# Altium project MCU042A.PrjPcb (part 3 of 3)

## Sheet MCU042A_Antenna_RF .SchDoc
size 431 x 279 mm; Date: Not shown in title block; ApprovedBy: Not shown in title block; CheckedBy: Not shown in title block; Author: Not shown in title block; CompanyName: Not shown in title block; DrawnBy: Vince Rodriguez; Engineer: Not shown in title block; Organization: Not shown in title block; Address1: Not shown in title block; Address2: Not shown in title block; Address3: Not shown in title block; Address4: Not shown in title block; DocumentNumber: 4; Revision: Use project parameter SCH_Rev; SheetNumber: 4; SheetTotal: 5; PageSetup: Record=PageOptions|CenterHorizontal=True|CenterVertical=True|PrintScale=1.00|XCorrection=1.00|YCorrection=1.00|PrintKind=0|BorderSize=5000000|LeftOffset=0|BottomOffset=0|Orientation=2|PaperLength=1000|PaperWidth=1000|Scale=100|PaperSource=15|PrintQuality=600|MediaType=1|DitherType=10|PaperKind=Letter|PrintScaleMode=1; CurrentTime: Not shown in title block; CurrentDate: Not shown in title block; Time: Not shown in title block; DocumentFullPathAndName: Not shown in title block; DocumentName: Not shown in title block; ModifiedDate: Not shown in title block; ImagePath: Not shown in title block
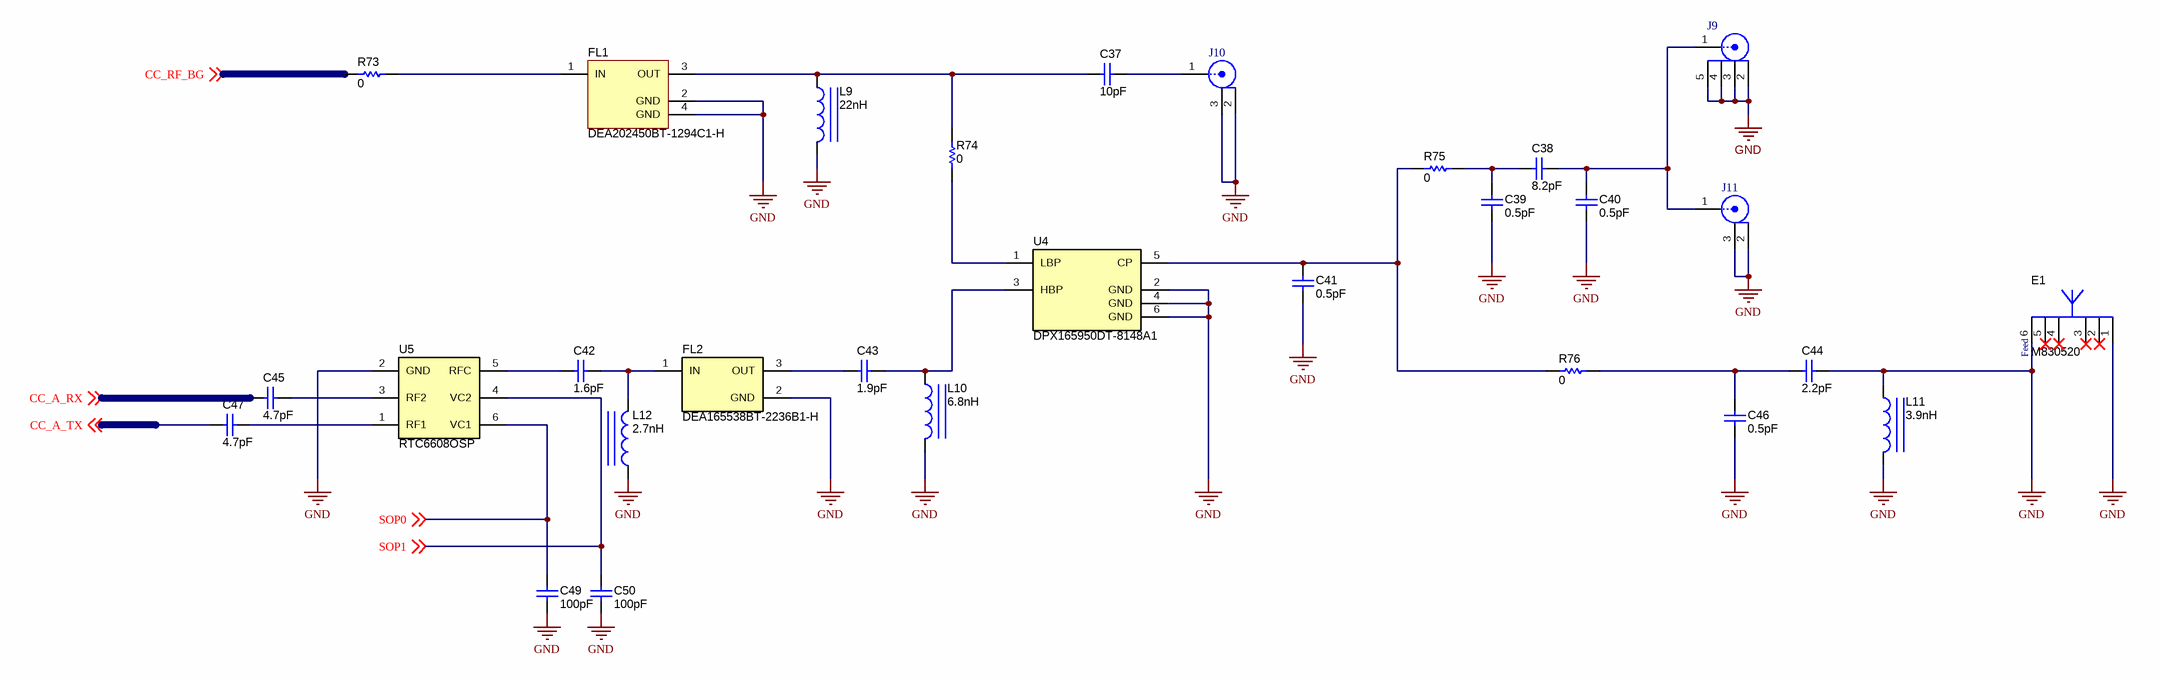
[diagram p6: MCU042A_Antenna_RF .SchDoc]

### Parts
C37  ValueDisplayed: 10pF  [0402S]  (hidden comment: CMP-0006408-2)
C38  ValueDisplayed: 8.2pF  [0402S]  (hidden comment: 0402N8R2C500CT)
C39  ValueDisplayed: 0.5pF  [0402S]  (hidden comment: GJM1555C1HR50BB01J)
C40  ValueDisplayed: 0.5pF  [0402S]  (hidden comment: GJM1555C1HR50BB01J)
C41  ValueDisplayed: 0.5pF  [0402S]  (hidden comment: GJM1555C1HR50BB01J)
C42  ValueDisplayed: 1.6pF  [0201_033]  (hidden comment: GRM0335C1H1R6BA01D)
C43  ValueDisplayed: 1.9pF  [0402S]  (hidden comment: GJM1555C1H1R9WB01D)
C44  ValueDisplayed: 2.2pF  [0402S]  (hidden comment: GJM1555C1H2R2BB01D)
C45  ValueDisplayed: 4.7pF  [0201_033]  (hidden comment: GRM0335C1H4R7BA01D)
C46  ValueDisplayed: 0.5pF  [0402S]  (hidden comment: GJM1555C1HR50BB01J)
C47  ValueDisplayed: 4.7pF  [0201_033]  (hidden comment: GRM0335C1H4R7BA01D)
C49  ValueDisplayed: 100pF  [0201]  (hidden comment: CC0201JRNPO8BN101)
C50  ValueDisplayed: 100pF  [0201]  (hidden comment: CC0201JRNPO8BN101)
E1  M830520  [Ethertronics_M830520]
FL1  PartNumber: DEA202450BT-1294C1-H  [TDK_DEA202450BT-1294C1-H]  (hidden comment: CMP-0002039-2)
FL2  PartNumber: DEA165538BT-2236B1-H  [TDK_DEA165538BT-2236B1-H]  (hidden comment: CMP-0002038-2)
J9  CMP-0055832-1  [Hustsan_SMA-10V21-TGG]  (value not drawn)
J10  U.FL-R-SMT-1(01)  [CONN_UFL-R-SMT-1]  (value not drawn)
J11  U.FL-R-SMT-1(01)  [CONN_UFL-R-SMT-1]  (value not drawn)
L9  ValueDisplayed: 22nH  [0402S]  (hidden comment: LQG15HZ22NH02D)
L10  ValueDisplayed: 6.8nH  [0402S]  (hidden comment: LQG15HZ6N8H02D)
L11  ValueDisplayed: 3.9nH  [IND_LQG15H]  (hidden comment: CMP-0058633-1)
L12  ValueDisplayed: 2.7nH  [0402S]  (hidden comment: LQG15WH2N7C02D)
R73  ValueDisplayed: 0  [0201]  (hidden comment: CRCW02010000Z0ED)
R74  ValueDisplayed: 0  [0402S]  (hidden comment: CMP-0026992-2)
R75  ValueDisplayed: 0  [0402S]  (hidden comment: CMP-0026992-2)
R76  ValueDisplayed: 0  [0402S]  (hidden comment: CMP-0026992-2)
U4  PartNumber: DPX165950DT-8148A1  [TDK_DPX165950DT-8148A1]  (hidden comment: CMP-0002040-1)
U5  RTC6608OSP  [Richwave_RTC6608OSP]

### Nets
GND: C39.2 C40.2 C41.2 C44.2 C46.2 C49.2 C50.2 E1.1(Feed) E1.6 FL1.2(GND) FL1.4(GND) FL2.2(GND) J9.2 J9.3 J9.4 J9.5 J10.2 J10.3 J11.2 J11.3 L9.2 L10.2 L11.1 L11.2 L12.1 U4.2(GND) U4.4(GND) U4.6(GND) U5.2(GND)
CC_A_RX: C45.2 ; off-sheet CC_A_RX
CC_A_TX: C47.2 ; off-sheet CC_A_TX
CC_RF_BG: R73.2 ; off-sheet CC_RF_BG
SOP0: C49.1 U5.6(VC1) ; off-sheet SOP0
SOP1: C50.1 U5.4(VC2) ; off-sheet SOP1
NetC37_1: C37.1 FL1.3(OUT) L9.1 R74.2
NetC37_2: C37.2 J10.1
NetC38_1: C38.1 C39.1 R75.2
NetC38_2: C38.2 C40.1 J9.1 J11.1
NetC41_1: C41.1 R75.1 R76.1 U4.5(CP)
NetC42_1: C42.1 FL2.1(IN) L12.2
NetC42_2: C42.2 U5.5(RFC)
NetC43_1: C43.1 FL2.3(OUT)
NetC43_2: C43.2 L10.1 U4.3(HBP)
NetC44_1: C44.1 C46.1 R76.2
NetC45_1: C45.1 U5.3(RF2)
NetC47_1: C47.1 U5.1(RF1)
NetFL1_1: FL1.1(IN) R73.1
NetR74_1: R74.1 U4.1(LBP)

Not connected (* = marked no-connect by the designer): E1 2(GND)* 3(GND)* 4(Feed)* 5*

### Notes on the sheet
- (near E1) Feed
- Drawn By:
- SVN Rev:
- Number:
- TID #:
- Orderable:
- Rev:
- Sheet Title:
- File:
- Project Title:
- Designed for:
- Assembly Variant:
- Mod. Date:
- Sheet:
- Size:
- of
- B
- http://www.ti.com
- Texas Instruments and/or its licensors do not warrant the accuracy or completeness of this specification or any information contained therein. Texas Instruments and/or its licensors do not warrant that this design will meet the specifications, will be suitable for your application or fit for any particular purpose, or will operate in an implementation. Texas Instruments and/or its licensors do not warrant that the design is production worthy. You should completely validate and test your design implementation to confirm the system functionality for your application.
- Engineer:
- Contact:
- © Texas Instruments

### Library data of the parts
C37 = CMP-0006408-2: CAP, CERM, 10 pF, 50 V, +/- 5%, C0G/NP0, 0402; PartNumber: GRM1555C1H100JA01D; Manufacturer: MuRata; Polarized: N; CompType: Capacitor; Value: 10pF; U/M: EA; Value1: Unknown; VDC_V: 50V; TaMin_C: -55°C; TaMax_C: 125°C; Cap_Case: 0402; SizeAreaWB_mm2: 3; SizeZ_mm: 0.6; SizeX_mm: 1; SizeY_mm: 0.5; AEC Category: Q200; PackageReference: 0402; RoHS: Y; Cap_F: 10pF; Tolerance_%: 5%; Value2: 50V; MountType: SMT; Technology: Ceramic; TempCo: C0G/NP0; Published: 2008-06-19; Publisher: Texas Instruments; LatestRevisionDate: 2017-03-09; ComponentLink1Description: Datasheet link; ComponentLink1URL: http://search.murata.co.jp/Ceramy/PnsearchViewAction.do?HnOFG=ON&HnNFG=ON&SEL_CNT=50&sLang=en&sKey=GRM1555C1H100JA01D&x=9&y=9&search=startwith; Alternate PartNumber: GRM1555C1H100JA01D; Alternate Manufacturer: MuRata; Supplier 1: Mouser; Supplier Part Number 1: 81-GRM1555C1H100JA1D; SizeArea_mm2: 0.5; AEC Qualified: ?
C38 = CMP-0085845-1: CAP, CERM, 8.2 pF, 50 V,+/- 3%, C0G/NP0, 0402; PartNumber: GJM1555C1H8R2BB01D; Manufacturer: MuRata; Alternate PartNumber: GRM1555C1H8R2CA01D; Polarized: N; Value: 8.2pF; U/M: EA; VDC_V: 50V; TaMin_C: -55°C; TaMax_C: 125°C; Cap_Case: 0402; SizeArea_mm2: 0.5; SizeAreaWB_mm2: 3; SizeX_mm: 1; SizeZ_mm: 0.6; AEC Category: Q200; CompType: Capacitor; PackageReference: 0402; RoHS: Y; Cap_F: 8.2pF; Tolerance_%: 3%; Value2: 50V; MountType: SMT; Technology: Ceramic; TempCo: C0G/NP0; SizeY_mm: 0.5; ComponentLink1Description: Datasheet link; ComponentLink1URL: http://www.passivecomponent.com/indexsea/0402N8R2C500CT-IN.pdf; Alternate Manufacturer: MuRata; AEC Qualified: N; AEC Grade: N/A
C39-C41 = CMP-0080073-1: CAP, CERM, 0.5 pF, 50 V,+/- 20%, C0G/NP0, 0402; Manufacturer: MuRata; Polarized: N; Value: 0.5pF; U/M: EA; VDC_V: 50V; TaMin_C: -55°C; TaMax_C: 125°C; Cap_Case: 0402; Green_Lifecycle: Active; SizeAreaWB_mm2: 3; Green_REACh: Passed; SizeZ_mm: 0.6; SizeX_mm: 1; SizeY_mm: 0.5; AEC Category: Q200; CompType: Capacitor; PartNumber: GJM1555C1HR50BB01J; PackageReference: 0402; RoHS: Y; Cap_F: 0.5pF; Tolerance_%: 20%; Value2: 50V; MountType: SMT; Technology: Ceramic; TempCo: C0G/NP0; ComponentLink1Description: Datasheet link; ComponentLink1URL: https://search.murata.co.jp/Ceramy/image/img/A01X/G101/ENG/GJM1555C1HR50BB01-01.pdf; Supplier 1: Digi-Key; Supplier Part Number 1: 490-8105-1-ND; Supplier 2: Mouser; Supplier Part Number 2: 81-GJM1555C1HR50BB1J; Green_EU RoHS-2: Incomplete; Green_EU RoHS: Passed; SizeArea_mm2: 0.5; AEC Qualified: N; AEC Grade: N/A
C42 = CMP-0080075-1: CAP, CERM, 1.6 pF, 50 V,+/- 7%, C0G/NP0, 0201; Manufacturer: MuRata; Polarized: N; Value: 1.6pF; U/M: EA; VDC_V: 50V; TaMin_C: -55°C; TaMax_C: 125°C; Cap_Case: 0201; SizeArea_mm2: 0.18; SizeAreaWB_mm2: 2.08; SizeX_mm: 0.6; SizeY_mm: 0.3; SizeZ_mm: 0.33; AEC Category: Q200; CompType: Capacitor; PartNumber: GRM0335C1H1R6BA01D; PackageReference: 0201; RoHS: Y; Cap_F: 1.6pF; Value2: 50V; MountType: SMT; Technology: Ceramic; TempCo: C0G/NP0; ComponentLink1Description: Datasheet link; ComponentLink1URL: https://search.murata.co.jp/Ceramy/image/img/A01X/G101/ENG/GRM0335C1H1R6BA01-01A.pdf; Supplier 1: Digi-Key; Supplier Part Number 1: 490-11312-1-ND; Supplier 2: Mouser; Supplier Part Number 2: 81-GRM0335C1H1R6BA1D; AEC Qualified: N; AEC Grade: N/A; Tolerance_%: 7%
C43 = CMP-0085853-1: CAP, CERM, 1.9 pF, 50 V,+/- 2.6%, C0G/NP0, 0402; Manufacturer: MuRata; Alternate PartNumber: GRM1555C1H1R9WA01D; Polarized: N; Value: 1.9pF; U/M: EA; VDC_V: 50V; TaMin_C: -55°C; TaMax_C: 125°C; Cap_Case: 0402; SizeArea_mm2: 0.5; SizeAreaWB_mm2: 3; SizeX_mm: 1; SizeZ_mm: 0.6; AEC Category: Q200; CompType: Capacitor; PartNumber: GJM1555C1H1R9WB01D; PackageReference: 0402; RoHS: Y; Cap_F: 1.9pF; Value2: 50V; MountType: SMT; Technology: Ceramic; TempCo: C0G/NP0; SizeY_mm: 0.5; ComponentLink1Description: Datasheet link; ComponentLink1URL: https://psearch.en.murata.com/capacitor/product/GJM1555C1H1R9WB01%23.pdf; AEC Qualified: N; AEC Grade: N/A; Tolerance_%: 2.6%
C44 = CMP-0085854-1: CAP, CERM, 2.2 pF, 50 V,+/- 4.5%, C0G/NP0, 0402; Manufacturer: MuRata; Alternate PartNumber: GRM1555C1H2R2BA01D; Polarized: N; Value: 2.2pF; U/M: EA; VDC_V: 50V; TaMin_C: -55°C; TaMax_C: 125°C; Cap_Case: 0402; SizeArea_mm2: 0.5; SizeAreaWB_mm2: 3; SizeX_mm: 1; SizeZ_mm: 0.6; AEC Category: Q200; CompType: Capacitor; PartNumber: GJM1555C1H2R2BB01D; PackageReference: 0402; RoHS: Y; Cap_F: 2.2pF; Tolerance_%: 4.5%; Value2: 50V; MountType: SMT; Technology: Ceramic; TempCo: C0G/NP0; SizeY_mm: 0.5; ComponentLink1Description: Datasheet link; ComponentLink1URL: https://psearch.en.murata.com/capacitor/product/GJM1555C1H2R2BB01%23.pdf; AEC Qualified: N; AEC Grade: N/A
C45 C47 = CMP-0080076-1: CAP, CERM, 4.7 pF, 50 V,+/- 3%, C0G/NP0, 0201; Manufacturer: MuRata; Polarized: N; Value: 4.7pF; U/M: EA; VDC_V: 50V; TaMin_C: -55°C; TaMax_C: 125°C; Cap_Case: 0201; SizeArea_mm2: 0.18; SizeAreaWB_mm2: 2.08; SizeX_mm: 0.6; SizeY_mm: 0.3; SizeZ_mm: 0.33; AEC Category: Q200; CompType: Capacitor; PartNumber: GRM0335C1H4R7BA01D; PackageReference: 0201; RoHS: Y; Cap_F: 4.7pF; Value2: 50V; MountType: SMT; Technology: Ceramic; TempCo: C0G/NP0; ComponentLink1Description: Datasheet link; ComponentLink1URL: https://search.murata.co.jp/Ceramy/image/img/A01X/G101/ENG/GRM0335C1H4R7BA01-01A.pdf; Supplier 1: Digi-Key; Supplier Part Number 1: 490-11332-1-ND; Supplier 2: Mouser; Supplier Part Number 2: 81-GRM0335C1H4R7BA1D; AEC Qualified: N; AEC Grade: N/A; Tolerance_%: 3%
C46 = GRM1555C1H1R0BA01D: CAP, CERM, 0.5 pF, 50 V, +/- 10%, C0G/NP0, 0402; Manufacturer: MuRata; Alternate PartNumber: ----; Polarized: N; CompType: Capacitor; Value: 0.5pF; U/M: EA; Cap_F: 0.000000000001; Tolerance_%: 10; Value1: Unknown; VDC_V: 50; Value2: 50V; TaMin_C: -55; TaMax_C: 125; Cap_Case: 0402; SymbolVersion: 2008-07-09; PartNumber: GJM1555C1HR50BB01J; PackageReference: 0402; RoHS: Y; MountType: SMT; Technology: Ceramic; TempCo: C0G/NP0; Published: 2008-06-19; Publisher: Texas Instruments; LatestRevisionDate: 2015-02-23; ComponentLink1Description: Datasheet link; ComponentLink1URL: http://psearch.murata.com/capacitor/product/GRM1555C1H1R0BA01%23.pdf; Alternate Manufacturer: ----; Supplier 1: Digi-Key; Supplier Part Number 1: 490-8105-1-ND; Supplier 2: Mouser; Supplier Part Number 2: 81-GJM1555C1HR50BB01J
C49 C50 = CMP-0085847-1: CAP, CERM, 100 pF, 25 V,+/- 5%, C0G/NP0, 0201; Manufacturer: Yageo; Alternate PartNumber: C0603C0G1E101J030BA; Polarized: N; Value: 100pF; U/M: EA; VDC_V: 25V; TaMin_C: -55°C; TaMax_C: 125°C; SizeArea_mm2: 0.18; SizeAreaWB_mm2: 2.08; SizeX_mm: 0.6; SizeY_mm: 0.3; SizeZ_mm: 0.26; AEC Category: Q200; CompType: Capacitor; PartNumber: CC0201JRNPO8BN101; PackageReference: 0201; RoHS: Y; Cap_F: 100pF; Tolerance_%: 5%; Value2: 25V; MountType: SMT; Technology: Ceramic; TempCo: C0G/NP0; Cap_Case: 0201; ComponentLink1Description: Datasheet link; ComponentLink1URL: http://www.yageo.com/documents/recent/UPY-GP_NP0_16V-to-50V_16.pdf; AEC Qualified: N; AEC Grade: N/A
E1 = CMP-0001857-1: WLAN ANTENNA 802.11, SMD; Manufacturer: Ethertronics; Alternate Manufacturer: ----; SizeAreaWB_mm2: 50; SizeArea_mm2: 24; SizeX_mm: 3; SizeY_mm: 8; SizeZ_mm: 1.33; PartNumber: M830520; CompType: Antenna; MountType: SMT; ComponentLink1Description: Datasheet URL; ComponentLink1URL: http://www.ethertronics.com/files/6014/0708/4228/Savvi_WLAN__8x3_M830510.pdf; RoHS: Y; PackageReference: 8x3mm; Publisher: Texas Instruments; LatestRevisionDate: 09/03/2017; Alternate PartNumber: ----
FL1 = CMP-0002039-2: Multilayer Chip Band Pass Filter For 2.4GHz W-LAN/Bluetooth, SMD; Manufacturer: TDK; Alternate Manufacturer: ----; Value: 1.02 dB; CompType: Filter; MountType: SMT; ComponentLink1Description: Datasheet URL; ComponentLink1URL: http://product.tdk.com/en/catalog/datasheets/rf_bpf_dea202450bt-1294c1-h_en.pdf; RoHS: Y; PackageReference: 2x1.25mm; Publisher: Texas Instruments; LatestRevisionDate: 09/03/2017; Alternate PartNumber: ----; Supplier 1: Digi-Key; Supplier Part Number 1: 445-172335-1-ND; Supplier 2: Newark; Supplier Part Number 2: 67X6091; Supplier 3: Mouser; Supplier Part Number 3: 810-DEA202450BT1294C
FL2 = CMP-0002038-2: Multilayer Band Pass Filter For 5GHz W-LAN/LTE-U; Manufacturer: TDK; Alternate Manufacturer: ----; SizeAreaWB_mm2: 4.68; SizeArea_mm2: 1.28; SizeX_mm: 1.6; SizeY_mm: 0.8; SizeZ_mm: 0.65; CompType: Filter; MountType: SMT; ComponentLink1Description: Datasheet URL; ComponentLink1URL: https://sps06.itg.ti.com/sites/KMS/crossdivteams/altium/docs/ComponentDatasheets/DEA165538BT-2236B1-H_Ver_3_0_160802.pdf; RoHS: Y; PackageReference: 1.6x0.8mm; Publisher: Texas Instruments; LatestRevisionDate: 09/03/2017; Alternate PartNumber: ----
J9 = CMP-0055832-1: Connector, SMA, Vertical, Gold, SMT; PartNumber: SMA-10V21-TGG; Manufacturer: Hus-Tsan Group Co., Ltd.; Alternate Manufacturer: 傲创; Alternate PartNumber: SMA-050710; CT: TRUE; CNHeader: FALSE; PackageReference: SMD, 4-Leads, Body 7.1x7.1mm; CompType: SMA; RoHS: Y; MountType: SMT; ComponentLink1Description: Datasheet URL; ComponentLink1URL: https://sps06.itg.ti.com/sites/KMS/crossdivteams/altium/docs/ComponentDatasheets/SMA-10V21.pdf; Publisher: Texas Instruments; LatestRevisionDate: 26/05/2017
J10 J11 = CMP-0075320-1: Receptacle, Ultra Miniature Coaxial, Male Pin, 50 ohm, SMT; Manufacturer: Hirose Electric Co. Ltd.; Alternate Manufacturer: ----; CNHeader: False; Gender: Female; ContactFinish: Gold; PartNumber: U.FL-R-SMT-1(01); PackageReference: Ultra small CO-AX SMD; CompType: Receptacle; RoHS: Y; MountType: SMT; ComponentLink1Description: Datasheet URL; ComponentLink1URL: https://www.hirose.com/product/en/download_file/key_name/U.FL%2DR%2DSMT%2D1%2801%29/category/Drawing%20(2D)/doc_file_id/37625/?file_category_id=6&item_id=03310472201&is_series=; Publisher: Texas Instruments; LatestRevisionDate: 2017-07-12; Alternate PartNumber: ----; Supplier 1: Digi-Key; Supplier Part Number 1: H122041-ND; Supplier 2: Newark; Supplier Part Number 2: 18K7517; Supplier 3: Mouser; Supplier Part Number 3: 798-U.FL-R-SMT01; Color: Beige; PinCount: 3; Orientation: Vertical; CT: False
L9 = CMP-0080371-1: Inductor, Multilayer, Air Core, 22 nH, 0.35 A, 0.42 ohm, AEC-Q200 Grade 1, SMD; Manufacturer: MuRata; Value: 22nH; Imax_A: 350mA; Irms: 0.35A @ 25C rise; DCR_ohm: 0.42; Value2: 0.35A; SizeAreaWB_mm2: 3; SizeZ_mm: 0.55; SizeX_mm: 1; SizeY_mm: 0.5; AEC Qualified: Y; AEC Category: Q200; CompType: Inductor; PartNumber: LQG15HZ22NH02D; PackageReference: 0402; Ind_H: 22nH; Value1: 0.42 ohm; Technology: Multilayer; MountType: SMT; Material: Air Core; ComponentLink1Description: Datasheet link; ComponentLink1URL: https://search.murata.co.jp/Ceramy/image/img/P02/JELF243B-9110.pdf; RoHS: Y; Supplier 1: Digi-Key; Supplier Part Number 1: 490-15154-1-ND; Supplier 2: Mouser; Supplier Part Number 2: 81-LQG15HZ22NH02D; SizeArea_mm2: 0.5; AEC Grade: 1
L10 = CMP-0080372-1: Inductor, Multilayer, Air Core, 6.8 nH, 0.6 A, 0.22 ohm, AEC-Q200 Grade 1, SMD; Manufacturer: MuRata; Value: 6.8nH; Imax_A: 600mA; Irms: 0.6A @ 25C rise; DCR_ohm: 0.22; Value2: 0.6A; SizeAreaWB_mm2: 3; SizeZ_mm: 0.55; SizeX_mm: 1; SizeY_mm: 0.5; AEC Qualified: Y; AEC Category: Q200; CompType: Inductor; PartNumber: LQG15HZ6N8H02D; PackageReference: 0402; Ind_H: 6.8nH; Value1: 0.22 ohm; Technology: Multilayer; MountType: SMT; Material: Air Core; ComponentLink1Description: Datasheet link; ComponentLink1URL: https://search.murata.co.jp/Ceramy/image/img/P02/JELF243B-9110.pdf; RoHS: Y; Supplier 1: Digi-Key; Supplier Part Number 1: 490-15174-1-ND; Supplier 2: Mouser; Supplier Part Number 2: 81-LQG15HZ6N8H02D; SizeArea_mm2: 0.5; AEC Grade: 1
L11 = CMP-0058633-1: Inductor, Multilayer, Air Core, 3.9 nH, 0.3 A, 0.18 ohm, SMD; PartNumber: LQG15HS3N9S02D; Manufacturer: MuRata; Alternate Manufacturer: ----; Value: 3.9nH; Imax_A: 3dA; Irms: 0.3A @ C rise; Isat: 0.3A @ % inductance drop; DCR_ohm: 1.8d; Value2: 0.3A; Green_Lifecycle: Active; SizeAreaWB_mm2: 3; Green_REACh: Passed; SizeZ_mm: 0.55; SizeX_mm: 1; SizeY_mm: 0.5; AEC Category: Q200; CompType: Inductor; PackageReference: 0402 polarized; Ind_H: 3.9nH; Value1: 0.18 ohm; Technology: Multilayer; MountType: SMT; Material: Air Core; Published: 2008-06-26; Publisher: Texas Instruments; LatestRevisionDate: 2017-06-02; ComponentLink1Description: Datasheet link; ComponentLink1URL: http://search.murata.co.jp/Ceramy/image/img/PDF/ENG/L0075S0083LQG15HS.pdf; RoHS: Y; Alternate PartNumber: ----; Supplier 1: Digi-Key; Supplier Part Number 1: 490-2617-1-ND; Supplier 2: Mouser; Supplier Part Number 2: 81-LQG15HS3N9S02D; Green_EU RoHS-2: Incomplete; Green_EU RoHS: Passed; SizeArea_mm2: 0.5; AEC Qualified: ?
L12 = CMP-0080374-1: Inductor, Multilayer, Air Core, 2.7 nH, 0.9 A, 0.07 ohm, AEC-Q200 Grade 1, SMD; Manufacturer: MuRata; Value: 2.7nH; Imax_A: 900mA; Irms: 0.9A @ 25C rise; DCR_ohm: 0.07; Value2: 0.9A; SizeAreaWB_mm2: 3.2; SizeZ_mm: 0.6; SizeX_mm: 1; AEC Qualified: Y; AEC Category: Q200; CompType: Inductor; PartNumber: LQG15WH2N7C02D; PackageReference: 0402; Ind_H: 2.7nH; Value1: 0.07 ohm; Technology: Multilayer; MountType: SMT; Material: Air Core; ComponentLink1Description: Datasheet link; ComponentLink1URL: https://search.murata.co.jp/Ceramy/image/img/P02/JELF243B-9118.pdf; RoHS: Y; Supplier 1: Digi-Key; Supplier Part Number 1: 490-15215-1-ND; Supplier 2: Mouser; Supplier Part Number 2: 81-LQG15WH2N7C02D; SizeY_mm: 0.6; SizeArea_mm2: 0.6; AEC Grade: 1
R73 = CMP-0027008-4: RES, 0, 5%, 0.05 W, 0201; Manufacturer: Vishay-Dale; Alternate PartNumber: ERJ-1GE0R00C; Value: 0; Value_Code: 0000; Power_W: 50mW; Value2: 0.05W; TempCo: ppm/C; SizeArea_mm2: 0.18; SizeX_mm: 0.6; SizeY_mm: 0.3; SizeZ_mm: 0.26; EIA_Code: E24; AEC Category: Q200; AEC Qualified: N; CompType: Resistor; PartNumber: CRCW02010000Z0ED; PackageReference: 0201; RoHS: E; Res_ohm: 0; Tolerance_%: 5%; Value1: 5%; MountType: SMT; Technology: Thick Film; ComponentLink1Description: Datasheet link; ComponentLink1URL: http://www.vishay.com/docs/20052/crcw0201e3.pdf; Supplier 1: Newark; Supplier Part Number 1: 72M6743; AEC Grade: N/A
R74-R76 = CMP-0026992-2: RES, 0, 5%, 0.063 W, 0402; PartNumber: ERJ-2GE0R00X; Manufacturer: Panasonic; Alternate Manufacturer: YAGEO; Alternate PartNumber: RC0402JR-070RL; CompType: Resistor; Value: 0; Value_Code: 0000; Power_W: 63mW; Value2: 0.063W; VDC_V: 50V; TempCo: 600 ppm/C; SizeArea_mm2: 0.5; SizeX_mm: 1; SizeZ_mm: 0.6; EIA_Code: E24; U/M: EA; AEC Category: Q200; PackageReference: 0402; RoHS: Y; Res_ohm: 0; Tolerance_%: 5%; Value1: 5%; MountType: SMT; Technology: Thick Film; SizeY_mm: 0.5; Published: 2008-06-26; Publisher: Texas Instruments; LatestRevisionDate: 2017-03-09; ComponentLink1Description: Datasheet link; ComponentLink1URL: http://www.panasonic.com/industrial/components/pdf/AOA0000CE1.pdf; Supplier 1: Digi-Key; Supplier Part Number 1: P0.0JCT-ND; Supplier 2: Newark; Supplier Part Number 2: 65T8307; Supplier 3: Mouser; Supplier Part Number 3: 667-ERJ-2GE0R00X; AEC Qualified: ?
U4 = CMP-0002040-1: Multilayer Diplexer for 2.4GHz W-LAN & Bluetooth / 5GHz W-LAN; Manufacturer: TDK; Alternate Manufacturer: ----; SizeAreaWB_mm2: 4.68; SizeArea_mm2: 1.28; SizeX_mm: 0.8; SizeY_mm: 1.6; SizeZ_mm: 0.7; CompType: Diplexer; MountType: SMT; ComponentLink1Description: Datasheet URL; ComponentLink1URL: https://sps06.itg.ti.com/sites/KMS/crossdivteams/altium/docs/ComponentDatasheets/DPX165950DT-8148A1.pdf; RoHS: Y; PackageReference: 1.6x0.8mm; Publisher: Texas Instruments; LatestRevisionDate: 09/03/2017; Alternate PartNumber: ----; Supplier 1: Digi-Key; Supplier Part Number 1: 445-174759-1-ND; Supplier 2: Mouser; Supplier Part Number 2: 810-DPX16595DT8148A1
U5 = CMP-0065464-1: 0.03 GHz-6 GHz SPDT Switch; Manufacturer: Richwave; Alternate Manufacturer: ----; Alternate PartNumber: Direct from MFR; SizeAreaWB_mm2: 4.0; SizeArea_mm2: 1.0; SizeZ_mm: 0.4; PartNumber: RTC6608OSP; SizeX_mm: 1.0; SizeY_mm: 1.0; MountType: SMT; ComponentLink1Description: Datasheet URL; ComponentLink1URL: https://sps06.itg.ti.com/sites/KMS/crossdivteams/altium/docs/ComponentDatasheets/T-ST-6608OSP-DST-001 R1.5 RTC6608OSP datasheet (2).pdf; RoHS: Y; PackageReference: 1x1mm; Publisher: Texas Instruments; LatestRevisionDate: 2017-06-05

## Sheet MCU042A_EVM_Hardware.SchDoc: EVM_Hardware
size 431 x 279 mm; Date: Not shown in title block; ApprovedBy: Not shown in title block; CheckedBy: Not shown in title block; Author: Not shown in title block; CompanyName: Not shown in title block; DrawnBy: Vince Rodriguez; Engineer: Not shown in title block; Organization: Not shown in title block; Address1: Not shown in title block; Address2: Not shown in title block; Address3: Not shown in title block; Address4: Not shown in title block; DocumentNumber: 5; Revision: Use project parameter SCH_Rev; SheetNumber: 5; SheetTotal: 5; PageSetup: Record=PageOptions|CenterHorizontal=True|CenterVertical=True|PrintScale=1.00|XCorrection=1.00|YCorrection=1.00|PrintKind=0|BorderSize=5000000|LeftOffset=0|BottomOffset=0|Orientation=2|PaperLength=1000|PaperWidth=1000|Scale=100|PaperSource=15|PrintQuality=600|MediaType=1|DitherType=10|PaperKind=Letter|PrintScaleMode=1; CurrentTime: Not shown in title block; CurrentDate: Not shown in title block; Time: Not shown in title block; DocumentFullPathAndName: Not shown in title block; DocumentName: Not shown in title block; ModifiedDate: Not shown in title block; ImagePath: Not shown in title block
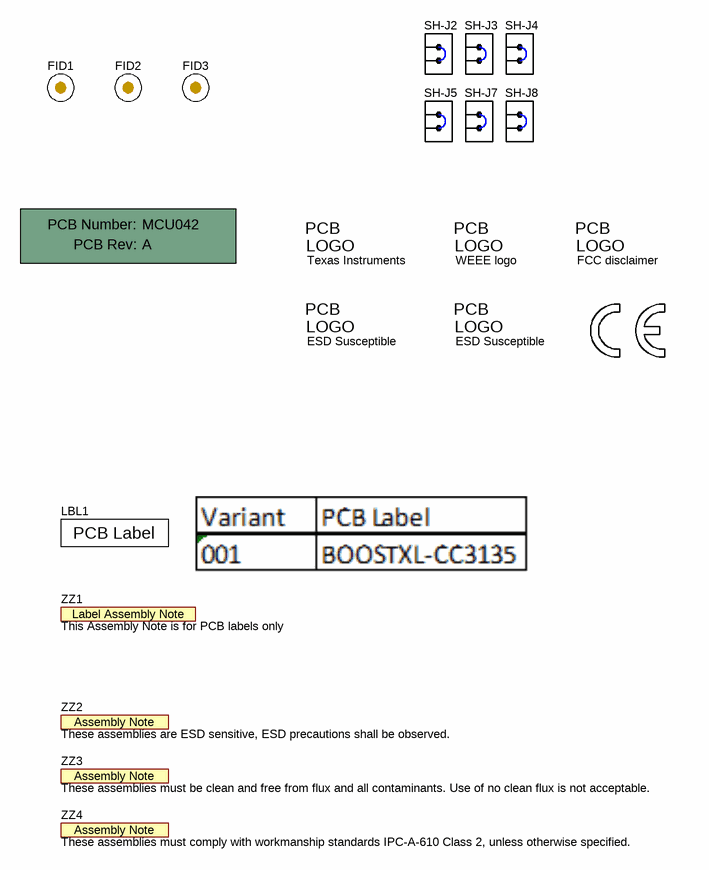
[diagram p7: MCU042A_EVM_Hardware.SchDoc]

### Parts
!PCB1  Printed Circuit Board  (value not drawn)  (mechanical)
FID1  CMP-0077181-1  [Fiducial10-20]  (value not drawn)  (no BOM)
FID2  CMP-0077181-1  [Fiducial10-20]  (value not drawn)  (no BOM)
FID3  CMP-0077181-1  [Fiducial10-20]  (value not drawn)  (no BOM)
LBL1  CMP-0003625-1  [Label_650x200]  (value not drawn)
Logo1  Texas Instruments  [TI_Stacked_Overlay_Small]  (no BOM)
Logo2  WEEE logo  [WEEE_Minimum]  (no BOM)
Logo3  FCC disclaimer  [FCC_disclaimer_stacked]  (no BOM)
Logo4  ESD Susceptible  [ESD_Overlay_Small]  (no BOM)
Logo5  ESD Susceptible  [ESD_Overlay_Small]  (no BOM)
Logo6  CMP-0074844-1  [CE_Mark_5mm]  (value not drawn)  (no BOM)
SH-J2  CMP-0003761-1  [Wurth_60900213421]  (value not drawn)
SH-J3  CMP-0003761-1  [Wurth_60900213421]  (value not drawn)
SH-J4  CMP-0003761-1  [Wurth_60900213421]  (value not drawn)
SH-J5  CMP-0003761-1  [Wurth_60900213421]  (value not drawn)
SH-J7  CMP-0003761-1  [Wurth_60900213421]  (value not drawn)
SH-J8  CMP-0003761-1  [Wurth_60900213421]  (value not drawn)
ZZ1  This Assembly Note is for PCB labels only  [AssemblyNoteLabel]  (no BOM)
ZZ2  These assemblies are ESD sensitive, ESD precautions shall be observed.  [AssemblyNote]  (no BOM)
ZZ3  These assemblies must be clean and free from flux and all contaminants. Use of no clean flux is not acceptable.  [AssemblyNote]  (no BOM)
ZZ4  These assemblies must comply with workmanship standards IPC-A-610 Class 2, unless otherwise specified.  [AssemblyNote]  (no BOM)

### Notes on the sheet
- Drawn By:
- SVN Rev:
- Number:
- TID #:
- Orderable:
- Rev:
- Sheet Title:
- File:
- Project Title:
- Designed for:
- Assembly Variant:
- Mod. Date:
- Sheet:
- Size:
- of
- B
- http://www.ti.com
- Texas Instruments and/or its licensors do not warrant the accuracy or completeness of this specification or any information contained therein. Texas Instruments and/or its licensors do not warrant that this design will meet the specifications, will be suitable for your application or fit for any particular purpose, or will operate in an implementation. Texas Instruments and/or its licensors do not warrant that the design is production worthy. You should completely validate and test your design implementation to confirm the system functionality for your application.
- Engineer:
- Contact:
- © Texas Instruments
- (in symbol CMP-0003616-3) Label Assembly Note
- (in symbol CMP-0003618-2) PCB Number:; PCB Rev:
- (in symbol CMP-0003625-1) PCB Label
- (in symbol CMP-0074769-1) PCB; LOGO
- (in symbol CMP-0074838-1) PCB; LOGO
- (in symbol CMP-0074840-1) PCB; LOGO
- (in symbol CMP-0074847-1) PCB; LOGO

### Library data of the parts
!PCB1 = CMP-0003618-2: Manufacturer: Any; PartNumber: MCU042; Alternate Manufacturer: ----; CompType: PCB; RoHS: O; MountType: N/A; Publisher: Texas Instruments; LatestRevisionDate: 2017-03-09; Alternate PartNumber: ----; Key: PCB
FID1-FID3 = CMP-0077181-1: Fiducial mark.  There is nothing to buy or mount.; CompType: Fiducial; Manufacturer: N/A; MountType: N/A; PackageReference: N/A; PartNumber: N/A; ClassName: FiducialMark; Library Reference: Fiducial
LBL1 = CMP-0003625-1: Thermal Transfer Printable Labels, 0.650" W x 0.200" H - 10,000 per roll; Manufacturer: Brady; PartNumber: THT-14-423-10; Alternate Manufacturer: ----; CompType: Label; Note: Size: 0.65" x 0.20 "; ClassName: Label; RoHS: Y; PackageReference: PCB Label 0.650 x 0.200 inch; MountType: N/A; ComponentLink1Description: Web Page; ComponentLink1URL: http://www.bradyid.com/bradyid/pdpv/THT-14-423-10.html; Publisher: Texas Instruments; LatestRevisionDate: 2017-03-09; Alternate PartNumber: ----; Supplier 1: Newark; Supplier Part Number 1: 97C5133; Supplier 2: Farnell; Supplier Part Number 2: 2065596; Key: THT-14-423-10
Logo1 = CMP-0074838-1: Texas Instrument Corporate Signature; SymbolCreator: a0412235; Library Reference: Logo; Lib Reference: TI_Logo; SymbolVersion: 2011-08-22; Published: 2009-03-03; Publisher: Texas Instruments; ClassName: Logo; LatestRevisionDate: 2017-07-06; PartNumber: Texas Instruments
Logo2 = CMP-0074769-1: Library Reference: WEEE logo; Lib Reference: WEEE logo; PartNumber: WEEE logo
Logo3 = CMP-0074847-1: FCC_disclaimer; Library Reference: Logo; Published: 2009-03-03; Publisher: Texas Instruments; LatestRevisionDate: 2017-07-06; Lib Reference: FCC_disclaimer; PartNumber: FCC disclaimer
Logo4 Logo5 = CMP-0074840-1: ESD Susceptible Symbol; SymbolCreator: a0412235; Library Reference: Logo; Lib Reference: ESD_Susceptible; SymbolVersion: 2011-08-22; Published: 2009-03-03; Publisher: Texas Instruments; LatestRevisionDate: 2017-07-06; PartNumber: ESD Susceptible
Logo6 = CMP-0074844-1: CE Mark; SymbolCreator: a0412235; Published: 2009-03-03; Publisher: Texas Instruments; LatestRevisionDate: 2017-07-06; Library Reference: CE Mark; Lib Reference: CE Mark; PartNumber: CE Mark
SH-J2-SH-J5 SH-J7 SH-J8 = CMP-0003761-1: Shunt, 2.54mm, Gold, Black; Manufacturer: Wurth Elektronik; PartNumber: 60900213421; Alternate Manufacturer: ----; CompType: Shunt; RoHS: Y; PackageReference: Shunt, 2.54mm, Black; MountType: N/A; ComponentLink1Description: Datasheet Link; ComponentLink1URL: http://katalog.we-online.de/em/datasheet/60900213421.pdf; Publisher: Texas Instruments; LatestRevisionDate: 2017-03-09; Alternate PartNumber: ----; Supplier 1: Digi-Key; Supplier Part Number 1: 732-2678-ND; Supplier 2: Newark; Supplier Part Number 2: 16T0609; Supplier 3: Mouser; Supplier Part Number 3: 710-60900213421; Key: 60900213421
ZZ1 = CMP-0003616-3: CompType: AssemblyNote; ClassName: AssemblyNote; Publisher: Texas Instruments; LatestRevisionDate: 2017-03-09; Key: AssemblyNoteLabel
ZZ2 = CMP-0077236-1: CompType: AssemblyNote; ClassName: AssemblyNote; Publisher: Texas Instruments; LatestRevisionDate: 2017-08-10; Key: AssemblyNote
ZZ3 = CMP-0077237-1: CompType: AssemblyNote; ClassName: AssemblyNote; Publisher: Texas Instruments; LatestRevisionDate: 2017-08-10; Key: AssemblyNote
ZZ4 = CMP-0077238-1: CompType: AssemblyNote; ClassName: AssemblyNote; Publisher: Texas Instruments; LatestRevisionDate: 2017-08-10; Key: AssemblyNote

## Nets that join several sheets
GND: MCU042A_Engine (46 pins), MCU042A_HOST INTERFACE (24 pins), MCU042A_Antenna_RF  (29 pins)
VBAT_CC: MCU042A_Engine (15 pins), MCU042A_HOST INTERFACE (C33.1 C34.1 J8.2 R57.2)
VCC_BRD: MCU042A_Engine (5 pins), MCU042A_HOST INTERFACE (11 pins)
VCC_LDO_3V3: MCU042A_Engine (R2.2), MCU042A_HOST INTERFACE (5 pins)
VCC_MCU_5V: MCU042A_Engine (R13.1), MCU042A_HOST INTERFACE (D1.2 P2.1)
CC_A_RX: MCU042A_Engine (U2.27), MCU042A_Antenna_RF  (C45.2)
CC_A_TX: MCU042A_Engine (U2.28), MCU042A_Antenna_RF  (C47.2)
CC_COEX_BLE_IN: MCU042A_Engine (U2.64), MCU042A_HOST INTERFACE (R29.1 R31.1)
CC_COEX_SW_OUT: MCU042A_Engine (U2.3), MCU042A_HOST INTERFACE (R28.1 R30.1)
CC_GPIO1: MCU042A_Engine (U2.1), MCU042A_HOST INTERFACE (R36.2)
CC_GPIO2: MCU042A_Engine (U2.18), MCU042A_HOST INTERFACE (R39.2)
CC_GPIO3: MCU042A_Engine (U2.53), MCU042A_HOST INTERFACE (R52.2)
CC_GPIO4: MCU042A_Engine (U2.63), MCU042A_HOST INTERFACE (R55.2)
CC_IRQ: MCU042A_Engine (R16.1 U2.15), MCU042A_HOST INTERFACE (R33.2)
CC_nHIB: MCU042A_Engine (U2.2), MCU042A_HOST INTERFACE (R32.1 R42.1 R67.1 SW1.2)
CC_nRESET: MCU042A_Engine (C30.1 R27.2 U2.32), MCU042A_HOST INTERFACE (D4.2 R68.1 SW2.2)
CC_NWP_UART_TX: MCU042A_Engine (U2.62), MCU042A_HOST INTERFACE (R44.1)
CC_RF_BG: MCU042A_Engine (U2.31), MCU042A_Antenna_RF  (R73.2)
CC_SPI_CLK: MCU042A_Engine (U2.5), MCU042A_HOST INTERFACE (R46.1)
CC_SPI_CS: MCU042A_Engine (U2.8), MCU042A_HOST INTERFACE (R34.2)
CC_SPI_DIN: MCU042A_Engine (U2.6), MCU042A_HOST INTERFACE (R43.2)
CC_SPI_DOUT: MCU042A_Engine (R15.1 U2.7), MCU042A_HOST INTERFACE (R45.2)
CC_UART1_CTS: MCU042A_Engine (U2.61), MCU042A_HOST INTERFACE (R37.1)
CC_UART1_RTS: MCU042A_Engine (R11.1 U2.50), MCU042A_HOST INTERFACE (R40.1)
CC_UART1_RX: MCU042A_Engine (R9.2 U2.57), MCU042A_HOST INTERFACE (R38.1)
CC_UART1_TX: MCU042A_Engine (R8.2 U2.55), MCU042A_HOST INTERFACE (R35.1)
CC_WAKEUP: MCU042A_Engine (U2.4), MCU042A_HOST INTERFACE (R49.2 R51.2)
CC_WL_UART_TX: MCU042A_Engine (U2.60), MCU042A_HOST INTERFACE (R47.1)
CC_WLRS232_RX: MCU042A_Engine (U2.59), MCU042A_HOST INTERFACE (R53.1)
CC_WLRS232_TX: MCU042A_Engine (U2.58), MCU042A_HOST INTERFACE (R50.1)
MCU_RESET_IN: MCU042A_Engine (R12.2), MCU042A_HOST INTERFACE (R41.2 R54.2 R64.2)
SOP0: MCU042A_Engine (C29.1 J5.2 U2.35), MCU042A_HOST INTERFACE (Q1.3), MCU042A_Antenna_RF  (C49.1 U5.6)
SOP1: MCU042A_Engine (J4.2 U2.34), MCU042A_HOST INTERFACE (Q1.6 R48.1), MCU042A_Antenna_RF  (C50.1 U5.4)

## Assembly variants
001: not fitted C25 C37 C39 C40 C41 C46 FID1 FID2 FID3 J1 J9 L9 L10 R2 R6 R7 R11 R14 R19 R20 R49 R50 R53 R54 R57 R75 Y2
001_SMA: not fitted C25 C37 C38 C39 C40 C41 C46 FID1 FID2 FID3 J1 J11 L9 L10 R2 R6 R7 R11 R14 R19 R20 R49 R50 R53 R54 R57 Y2